# EAGLE design LB_BIT_o15_UV_LED-v03(rev1) (EAGLE 6.6.0)
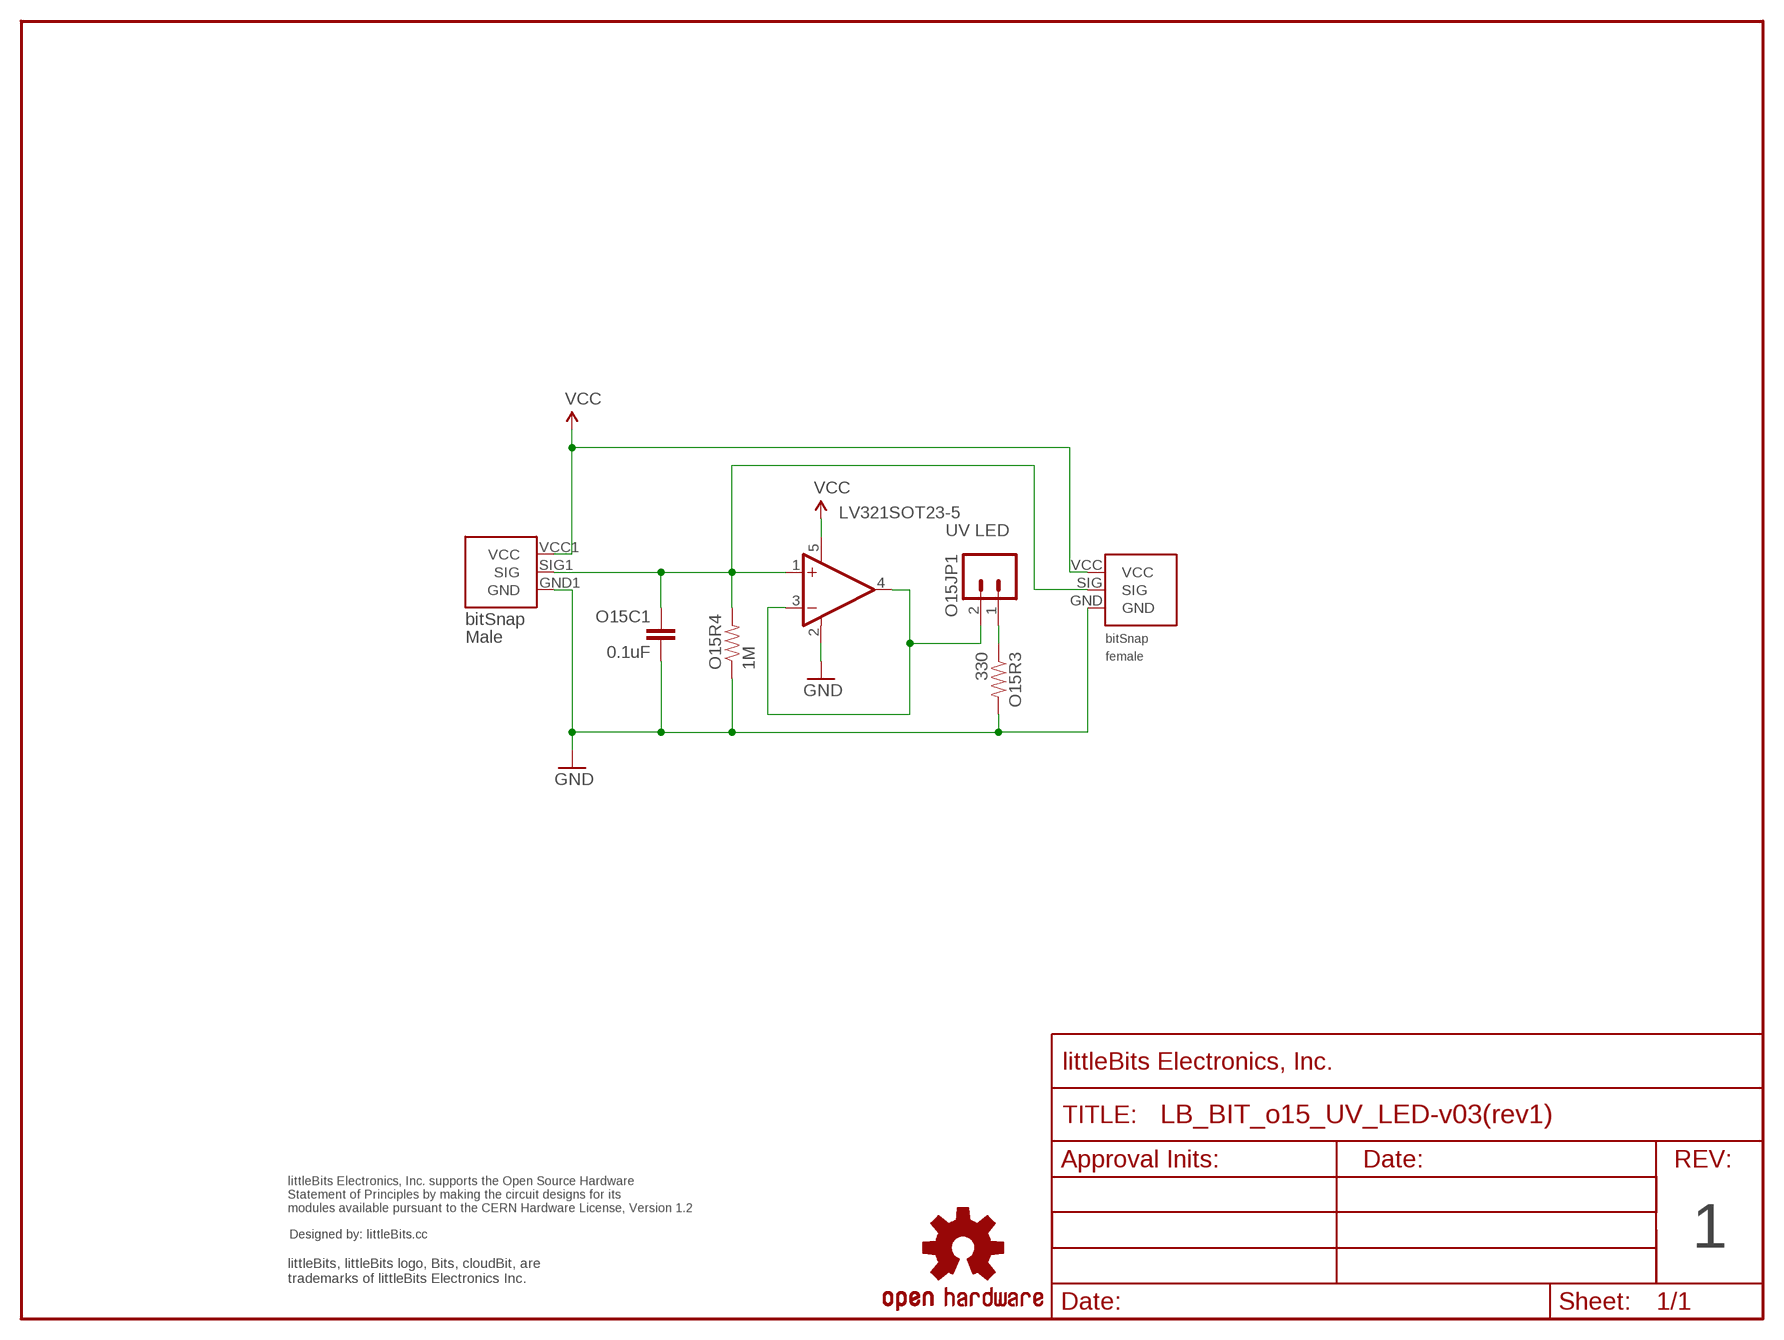
[diagram p0: schematic, sheet 1]

## Parts
O15BSF1  BITSNAP_V03_FEMALE  [BITSNAP_V03_FEMALE]
O15BSM1  BITSNAP_V03_MALE  [BITSNAP_V03_MALE]
O15C1  0.1uF  CAP0603-CAP  [0603-CAP]
O15JP1  M02-JST-2MM-SMT  [S2B-PH]
O15R3  330  RESISTOR0603-RES  [0603-RES]
O15R4  1M  RESISTOR0603-RES  [0603-RES]
O15U1  LV321SOT23-5  [SOT23-5]
U$1  FRAME-LETTER-OHWOHW  [FABDWG01-OHW]
U$3  OSHW-LOGOL  [OSHW-LOGO-L]
U$4  OSHWCREDIT  [OSHWCREDIT]

## Nets
GND: O15BSF1.GND O15BSM1.GND1(GND) O15C1.2 O15R3.2 O15R4.1 O15U1.2(V-)
N$1: O15JP1.2 O15U1.3(-IN) O15U1.4(OUT)
N$2: O15JP1.1 O15R3.1
SIG: O15BSF1.SIG O15BSM1.SIG1(SIG) O15C1.1 O15R4.2 O15U1.1(+IN)
VCC: O15BSF1.VCC O15BSM1.VCC1(VCC) O15U1.5(V+)

## Notes on the sheet
- UV LED
- 1

## Library data of the parts
O15BSF1 = bitSnap:BITSNAP_V03_FEMALE
O15BSM1 = bitSnap:BITSNAP_V03_MALE
O15C1 = SparkFun:CAP: Capacitor Standard 0603 ceramic capacitor, and 0.1" leaded capacitor.
O15JP1 = SparkFun:M02: Header 2 Standard 2-pin 0.1" header. Use with straight break away headers (SKU : PRT-00116), right angle break away headers (PRT-00553), swiss pins (PRT-00743), machine pins (PRT-00117), and female headers (PRT-00115). Molex polarized connector foot print use with SKU : PRT-08233 with associated crimp pins and housings.
O15R3 O15R4 = SparkFun:RESISTOR: Resistor Basic schematic elements and footprints for 0603, 1206, and PTH 1/10th watt (small) resistors.
O15U1 = LITTLEBITS:LV321
U$1 = LITTLEBITS:FRAME-LETTER-OHW
U$3 = LITTLEBITS:OSHW-LOGO: Open Source Hardware Logo This logo indicates the piece of hardware it is found on incorporates a OSHW license and/or adheres to the definition of open source hardware found here: http://freedomdefined.org/OSHW
U$4 = LITTLEBITS:OSHWCREDIT

## Board
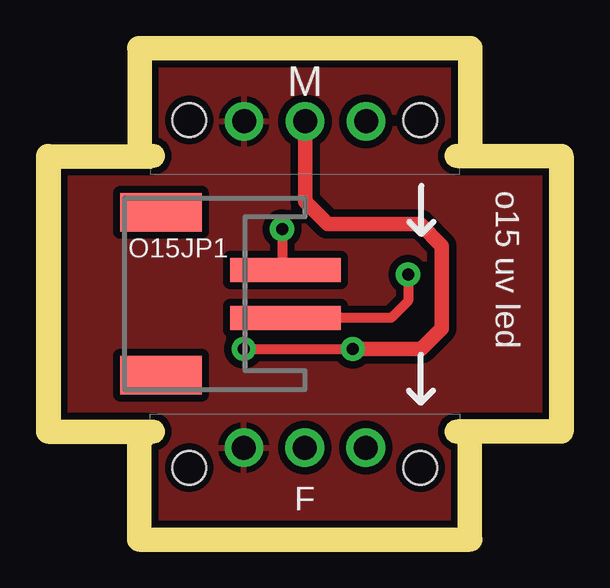
[diagram p1: board, top side]
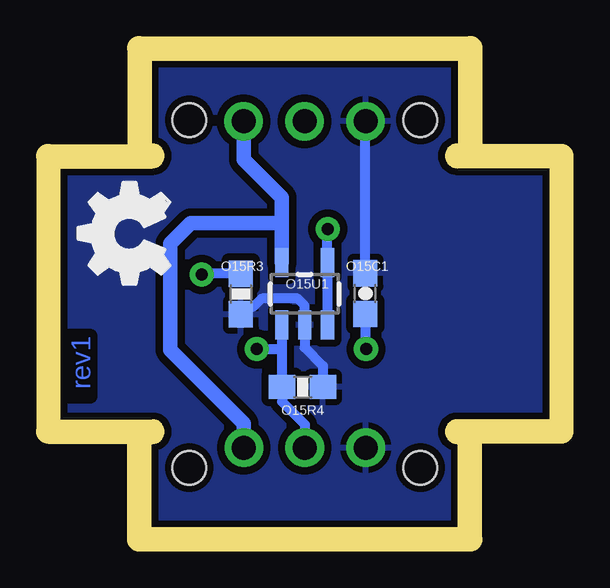
[diagram p2: board, bottom side, seen from below]

Size 20.4 x 19.5 mm. Coordinates in mm from the lower left corner, seen from the top.
Outline: 0,15 0,4.5
Outline: 20.4,4.5 20.4,15
Copper layers (1*16): Top 0.035mm / dielectric 1.5mm / Bottom 0.035mm
Design rules "default": minimum track width 8mil, minimum drill 20mil, track to track 8mil, track to pad 8mil, pad to pad 8mil, via to via 8mil, smd to smd 8mil, copper to edge 10mil, drill to drill 8mil, minimum pad ring 12mil, minimum via ring 10mil, stop-mask expansion 4mil, vias tented up to drill 25mil, thermal gap 10mil
Milling: 2 lines

### Footprints (pad centres in the part's own frame; a part is rotated, then mirrored left to right if it is on the bottom)
BITSNAP_V03_FEMALE = drill 1: GND 3.91,3.33; SIG 6.45,3.33; VCC 8.99,3.33 | hole 1.4: 1.63,2.5; 11.27,2.5
BITSNAP_V03_MALE = drill 1: GND1 8.98,2.56; SIG1 6.44,2.56; VCC1 3.9,2.56 | hole 1.4: 11.27,2.5; 1.63,2.5
0603-CAP = smd 1.1 x 1: 1 -0.85,0; 2 0.85,0
S2B-PH = smd 1 x 4.6: 1 -1,-3.7; 2 1,-3.7 | smd 1.6 x 3.4: NC1 -3.4,1.5; NC2 3.4,1.5
0603-RES = smd 1.1 x 1: 1 -0.85,0; 2 0.85,0
SOT23-5 = smd 0.55 x 1.2: 1 -0.95,-1.3; 2 0,-1.3; 3 0.95,-1.3; 4 0.95,1.3; 5 -0.95,1.3

### Placement (x,y rotation side)
O15BSF1  3.75,0 0 top
O15BSM1  16.65,19.5 180 top
O15C1  7.68,9.76 90 bottom
O15JP1  5.7,9.75 90 top
O15R3  12.86,9.74 270 bottom
O15R4  10.29,5.86 180 bottom
O15U1  10.21,9.75 0 bottom
U$1  0.1,0.15 0 top
U$3  -80.03,-59.49 0 top  (outside the outline)
U$4  -70.7,-62.9 0 top  (outside the outline)
U$6  [OSHW_FILLX150_NOTEXT]  15.83,9.31 0 top

### Tracks (layer width: path | path; a pad name or v marks a point on that pad's centre or on a via)
GND
  Bottom 0.406: O15R4.1 9.45,6.75 10.21,7.51 O15U1.2 10.21,9.26 10.5,9.55 12,9.55 12.35,9.2 12.55,9.2 O15R3.2 | O15C1.2 7.68,17.03 O15BSM1.GND1
  pour Top (isolate 0.305): 0.15,19.33 20.27,19.33 20.27,0.15 0.15,0.15
  pour Bottom (isolate 0.305): 0.15,19.33 0.15,0.15 20.27,0.15 20.27,19.33
N$1  (via drill 0.5)
  Top 0.406: v9.25,12.45 9.25,10.75 | 9.25,10.75 9.2,10.75 | 9.25,10.75 O15JP1.2
  Bottom 0.406: O15U1.3 O15U1.4 9.26,12.39 v9.25,12.45
N$2  (via drill 0.5)
  Top 0.406: v14.5,10.55 14.5,9.45 13.8,8.75 O15JP1.1
  Bottom 0.406: O15R3.1 14.46,10.59 v14.5,10.55
SIG  (via drill 0.5)
  Top 0.406: v7.65,7.45 v12.2,7.45
  Top 0.61: O15BSM1.SIG1 10.21,13.59 11.15,12.65 15,12.65 15.9,11.75 15.9,8.3 15.05,7.45 v12.2,7.45
  Bottom 0.406: O15U1.1 11.16,7.45 | 11.16,7.45 11.16,5.87 O15R4.2 11.14,5.24 10.2,4.3 O15BSF1.SIG | O15C1.1 7.68,7.58 v7.65,7.45 | v12.2,7.45 11.16,7.45
VCC
  Bottom 0.61: O15U1.5 11.16,12.7 | 11.16,12.7 11.16,13.76 12.75,15.35 O15BSM1.VCC1 | O15BSF1.VCC 12.74,4.34 15.8,7.4 15.8,11.85 14.95,12.7 11.16,12.7

### Text on the board
Bottom: rev1
tPlace: o15 uv led
tValues: UV LED
Milling: 1mm DIA. ROUTER PATH
Reference: SMALL
dxf: o15 UV LED BIT PCB | 1 | LB-BIT-o15-UVLED-v03-GERBER-rev1 (8-31-2012)